# Altium schematic sheet [06] Gyroscope.SchDoc: Gyroscope
size A3; Author: Caner ALP; Organization: ALP Electronics; Address1: Axel Oxenstiernas; Address2: Västerås; Address3: 72478; Address4: Sweden; DocumentNumber: 7; SheetNumber: 7; SheetTotal: 7
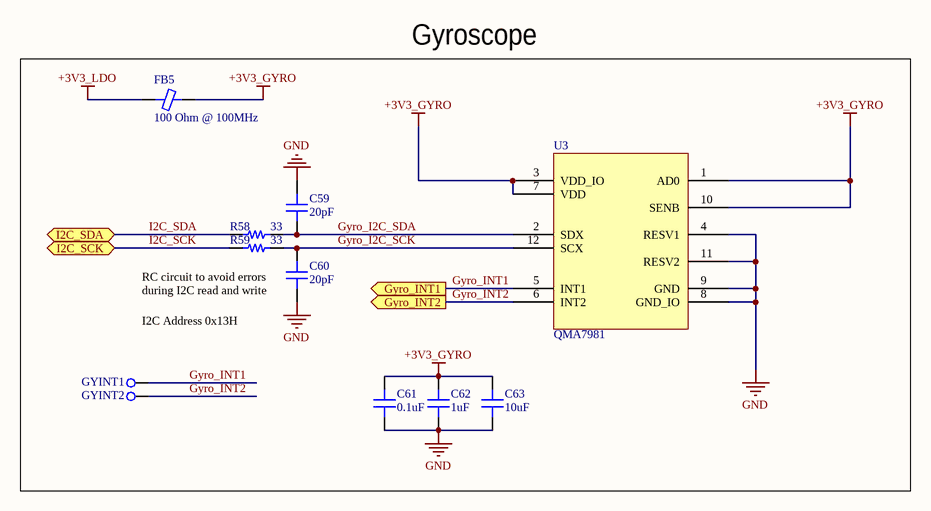
[diagram p0: [06] Gyroscope.SchDoc]

## Parts
C59  20pF  [CAP 0402/1005]
C60  20pF  [CAP 0402/1005]
C61  0.1uF  [CAP 0402/1005]
C62  1uF  [CAP 0603/1608]
C63  10uF  [CAP 0603/1608]
FB5  100 Ohm @ 100MHz  [FER 0603/1608]
GYINT1  RCT-0C  [0.5mm-TestPad]  (value not drawn)
GYINT2  RCT-0C  [0.5mm-TestPad]  (value not drawn)
R58  33  [RES 0402/1005]
R59  33  [RES 0402/1005]
U3  QMA7981  [LGA-12 2x2]

## Ports
Gyro_INT1 (out), Gyro_INT2 (out), I2C_SCK (bidir), I2C_SDA (bidir)

## Nets
+3V3_GYRO: C61.2 C62.2 C63.2 FB5.2 U3.1(AD0) U3.3(VDD_IO) U3.7(VDD) U3.10(SENB)
+3V3_LDO: FB5.1
GND: C59.2 C60.1 C61.1 C62.1 C63.1 U3.4(RESV1) U3.8(GND_IO) U3.9(GND) U3.11(RESV2)
Gyro_I2C_SCK: C60.2 R59.2 U3.12(SCX)
Gyro_I2C_SDA: C59.1 R58.2 U3.2(SDX)
Gyro_INT1: GYINT1.1(TP) U3.5(INT1) ; port Gyro_INT1
Gyro_INT2: GYINT2.1(TP) U3.6(INT2) ; port Gyro_INT2
I2C_SCK: R59.1 ; port I2C_SCK
I2C_SDA: R58.1 ; port I2C_SDA

## Notes on the sheet
- Gyroscope
- RC circuit to avoid errors
  during I2C read and write
- I2C Address 0x13H
- Title
- Size:
- Project
- A3
- Revision:
- Date:
- Sheet
- of

## Library data of the parts
C59 C60 = GRM1555C1E200JA01D: CAP CER 20PF 25V NP0 0402; Manufacturer: Murata Electronics North America; TemperatureRange: -55C ~ 125C; TemperatureCoefficient: C0G, NP0; Tolerance: 5%; Value: 20pF; Part Number: GRM1555C1E200JA01D; PartId: 5066; Supplier 1: Digi-Key; Supplier Part Number 1: 490-11364-2-ND; ComponentLink1Description: Datasheet; ComponentLink1URL: http://www.murata.com/~/media/webrenewal/support/library/catalog/products/capacitor/mlcc/c02e.ashx; ComponentLink2Description: Digi-Key listing; ComponentLink2URL: http://digikey.com/product-detail/en/GRM1555C1E200JA01D/490-11364-2-ND/3693725; Voltage: 25V; Price: 0,0118; Type: -; Device Package: 0402 (1005 Metric)
C61 = C1005X7R1A104K050BB: CAP CER 0.1UF 10V X7R 0402; Manufacturer: TDK Corporation; TemperatureRange: -55C ~ 125C; Tolerance: 10%; Value: 0.1uF; Part Number: C1005X7R1A104K050BB; PartId: 3900; Supplier 1: Digi-Key; Supplier Part Number 1: 445-4958-2-ND; ComponentLink1Description: Datasheet; ComponentLink1URL: https://product.tdk.com/info/en/catalog/datasheets/mlcc_commercial_general_en.pdf; ComponentLink2Description: Digi-Key listing; ComponentLink2URL: http://digikey.com/product-detail/en/C1005X7R1A104K050BB/445-4958-2-ND/2093226; TemperatureCoefficient: X7R; Voltage: 10V; Price: 0,0066; Type: -; Device Package: 0402 (1005 Metric)
C62 = CGB3B1X7R1A105K055AC: CAP CER 1UF 10V X7R 0603; Manufacturer: TDK Corporation; TemperatureRange: -55C ~ 125C; Tolerance: 10%; Type: Low Profile; Value: 1uF; Part Number: CGB3B1X7R1A105K055AC; PartId: 4131; Supplier 1: Digi-Key; Supplier Part Number 1: 445-13228-1-ND; ComponentLink1Description: Datasheet; ComponentLink1URL: https://product.tdk.com/info/en/catalog/datasheets/mlcc_commercial_lowprofile_en.pdf; ComponentLink2Description: Digi-Key listing; ComponentLink2URL: http://digikey.com/product-detail/en/CGB3B1X7R1A105K055AC/445-13228-1-ND/3954894; TemperatureCoefficient: X7R; Voltage: 10V; Price: 0,27; Device Package: 0603 (1608 Metric)
C63 = C1608X5R1A106M080AC: CAP CER 10UF 10V X5R 0603; Manufacturer: TDK Corporation; TemperatureRange: -55C ~ 85C; Tolerance: 20%; Value: 10uF; Part Number: C1608X5R1A106M080AC; PartId: 13099; Supplier 1: Digi-Key; Supplier Part Number 1: 445-6853-2-ND; ComponentLink1Description: Datasheet; ComponentLink1URL: https://product.tdk.com/info/en/catalog/datasheets/mlcc_commercial_general_en.pdf; ComponentLink2Description: Digi-Key Listing; ComponentLink2URL: https://www.digikey.com/product-detail/en/tdk-corporation/C1608X5R1A106M080AC/445-6853-2-ND/2619194; TemperatureCoefficient: X5R; Voltage: 10V; Price: 0,0935; Device Package: 0603 (1608 Metric)
FB5 = BKP1608HS101-T: FERRITE CHIP 100 OHM 0603; Manufacturer: Taiyo Yuden; Type: Differential Mode - Single; DC Resistance: 50 mOhm Max; Current Rating: 1.7A; Part Number: BKP1608HS101-T; PartId: 6594; Value: 100 Ohm @ 100MHz; Supplier 1: Digi-Key; Supplier Part Number 1: 587-1922-2-ND; ComponentLink1Description: Datasheet; ComponentLink1URL: http://ds.yuden.co.jp/TYCOMPAS/ut/detail.do?productNo=BKP1608HS101-T&fileName=BKP1608HS101-T_SS&mode=specSheetDownload; ComponentLink2Description: Digi-Key listing; ComponentLink2URL: http://digikey.com/product-detail/en/BKP1608HS101-T/587-1922-2-ND/957775; Price: 0,0247; Device Package: 0603 (1608 Metric)
GYINT1 GYINT2 = RCT-0C: 0805 PROBE PAD; Manufacturer: TE Connectivity AMP Connectors; Part Number: RCT-0C; PartId: 15704; Supplier 1: Digi-Key; Supplier Part Number 1: A106144CT-ND; ComponentLink1Description: Datasheet; ComponentLink1URL: http://www.te.com/commerce/DocumentDelivery/DDEController?Action=srchrtrv&DocNm=1773266&DocType=DS&DocLang=English; ComponentLink2Description: Digi-Key Listing; ComponentLink2URL: http://www.digikey.com/product-detail/en/te-connectivity-amp-connectors/RCT-0C/A106144CT-ND/3477801; Price: 0,14; Type: PC Test Point; Mounting Type: Surface Mount
R58 R59 = ERJ-2GEJ330X: RES SMD 33 OHM 5% 1/10W 0402; Manufacturer: Panasonic Electronic Components; TemperatureRange: -55C ~ 155C; TemperatureCoefficient: 200ppm/C; PowerRating: 0.1W, 1/10W; Value: 33; Part Number: ERJ-2GEJ330X; PartId: 10984; Supplier 1: Digi-Key; Supplier Part Number 1: P33JTR-ND; ComponentLink1Description: Datasheet; ComponentLink1URL: http://industrial.panasonic.com/www-cgi/jvcr13pz.cgi?E+PZ+3+AOA0001+ERJ2GEJ330X+7+WW; ComponentLink2Description: Digi-Key Listing; ComponentLink2URL: https://www.digikey.com/product-detail/en/panasonic-electronic-components/ERJ-2GEJ330X/P33JTR-ND/146980; Tolerance: 5%; Price: 0,0019; Device Package: 0402 (1005 Metric)
U3 = QMA7981: 3 AXIS ACCEL 12LGA; Manufacturer: QST; Sensor Type: Accelerometer, 3 Axis; Output Type: IC, SPI; Part Number: QMA7981; PartId: 16471; Supplier 1: LCSC; Supplier Part Number 1: C457290; ComponentLink1Description: Datasheet; ComponentLink1URL: https://datasheet.lcsc.com/szlcsc/2004281102_QST-QMA7981_C457290.pdf; ComponentLink2Description: LCSC Listing; ComponentLink2URL: https://lcsc.com/product-detail/Motion-Sensors-Accelerometers_QST-QMA7981_C457290.html; Type: Multifunction; Series: MotionTracking; Operating Temperature: -40C ~ 85C (TA)